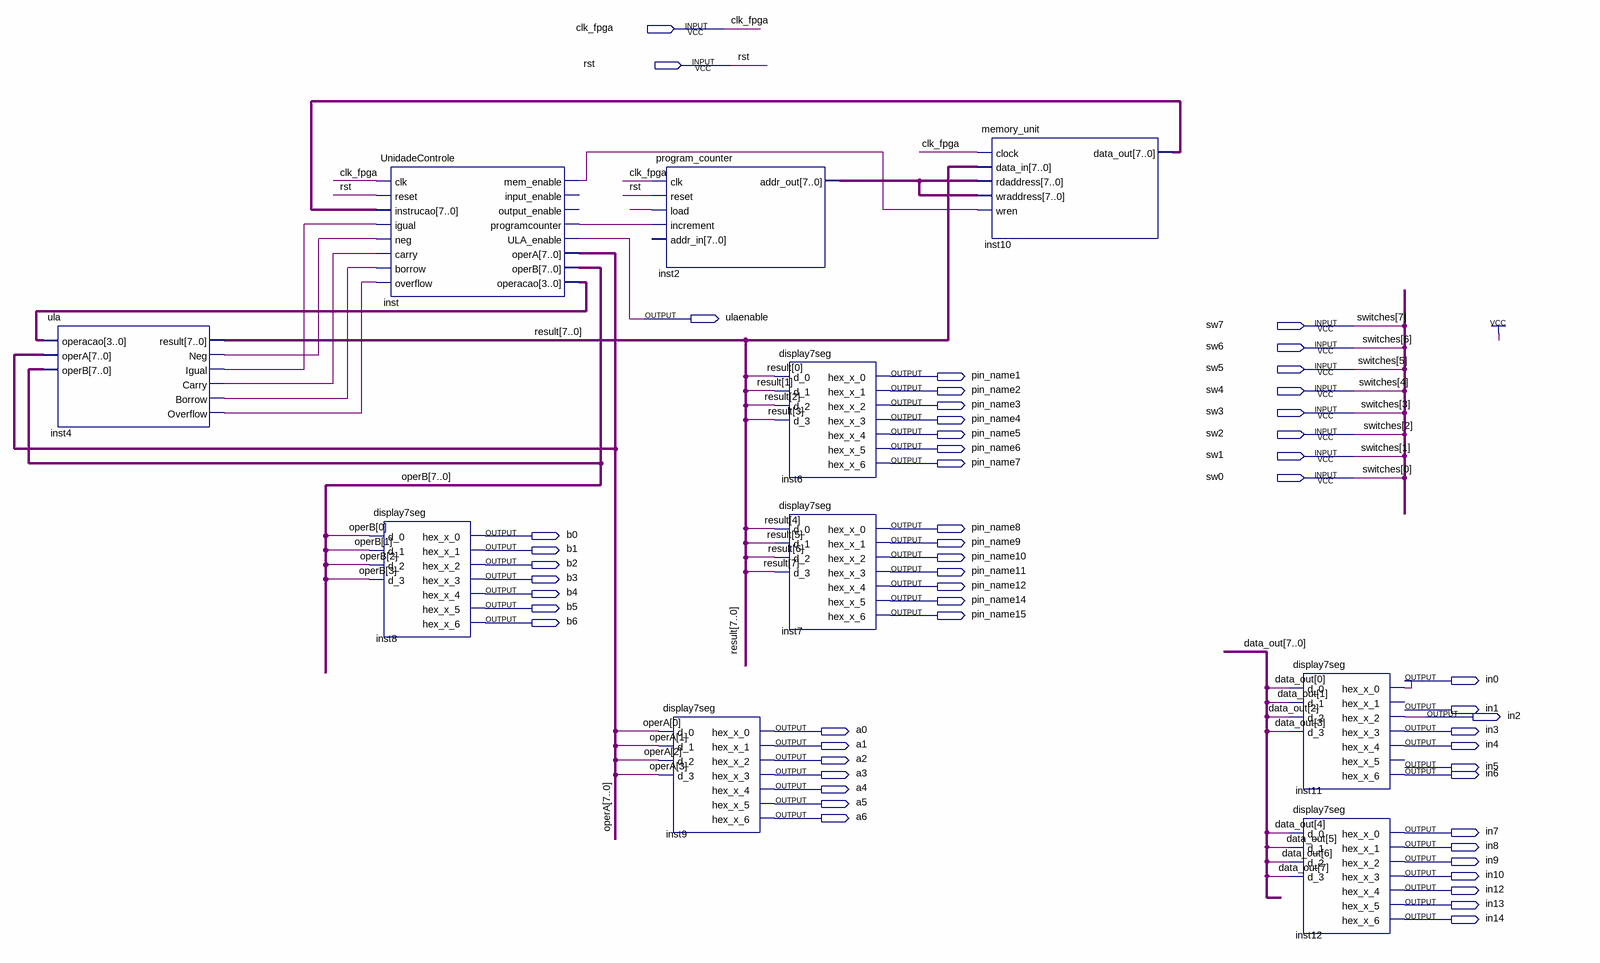
[diagram p0: schematic sheet]
// Quartus schematic cpu.bdf as structural Verilog: 10 symbols, 53 pins
module cpu (
  input  clk_fpga,
  input  rst,
  input  sw7,
  input  sw6,
  input  sw5,
  input  sw4,
  input  sw3,
  input  sw2,
  input  sw1,
  input  sw0,
  output ulaenable,
  output pin_name1,
  output pin_name2,
  output pin_name3,
  output pin_name4,
  output pin_name5,
  output pin_name6,
  output pin_name7,
  output pin_name8,
  output b0,
  output pin_name9,
  output b1,
  output pin_name10,
  output b2,
  output pin_name11,
  output b3,
  output pin_name12,
  output b4,
  output pin_name14,
  output b5,
  output pin_name15,
  output b6,
  output in0,
  output in1,
  output in2,
  output a0,
  output in3,
  output a1,
  output in4,
  output a2,
  output in5,
  output a3,
  output in6,
  output a4,
  output a5,
  output a6,
  output in7,
  output in8,
  output in9,
  output in10,
  output in12,
  output in13,
  output in14
);

  wire inst4_borrow, inst4_carry, inst4_igual, inst4_neg, inst4_overflow, inst_mem_enable,
       inst_programcounter, undriven;
  wire [3:0] inst_operacao;
  wire [7:0] data_out, inst2_addr_out, inst10_data_out, operA, operB, result;

  ula inst4 (
    .operacao(inst_operacao), .operA(operA), .operB(operB), .result(result), .Neg(inst4_neg),
    .Igual(inst4_igual), .Carry(inst4_carry), .Borrow(inst4_borrow), .Overflow(inst4_overflow));
  UnidadeControle inst (
    .clk(clk_fpga), .reset(rst), .instrucao(inst10_data_out), .igual(inst4_igual), .neg(inst4_neg),
    .carry(inst4_carry), .borrow(inst4_borrow), .overflow(inst4_overflow), .mem_enable(inst_mem_enable),
    .programcounter(inst_programcounter), .ULA_enable(ulaenable), .operA(operA), .operB(operB),
    .operacao(inst_operacao));  // open: input_enable, output_enable
  display7seg inst8 (
    .d_0(operB[0]), .d_1(operB[1]), .d_2(operB[2]), .d_3(operB[3]), .hex_x_0(b0), .hex_x_1(b1), .hex_x_2(b2),
    .hex_x_3(b3), .hex_x_4(b4), .hex_x_5(b5), .hex_x_6(b6));
  program_counter inst2 (
    .clk(clk_fpga), .reset(rst), .load(undriven), .increment(inst_programcounter), .addr_out(inst2_addr_out));  // open: addr_in
  display7seg inst9 (
    .d_0(operA[0]), .d_1(operA[1]), .d_2(operA[2]), .d_3(operA[3]), .hex_x_0(a0), .hex_x_1(a1), .hex_x_2(a2),
    .hex_x_3(a3), .hex_x_4(a4), .hex_x_5(a5), .hex_x_6(a6));
  display7seg inst6 (
    .d_0(result[0]), .d_1(result[1]), .d_2(result[2]), .d_3(result[3]), .hex_x_0(pin_name1),
    .hex_x_1(pin_name2), .hex_x_2(pin_name3), .hex_x_3(pin_name4), .hex_x_4(pin_name5), .hex_x_5(pin_name6),
    .hex_x_6(pin_name7));
  display7seg inst7 (
    .d_0(result[4]), .d_1(result[5]), .d_2(result[6]), .d_3(result[7]), .hex_x_0(pin_name8),
    .hex_x_1(pin_name9), .hex_x_2(pin_name10), .hex_x_3(pin_name11), .hex_x_4(pin_name12),
    .hex_x_5(pin_name14), .hex_x_6(pin_name15));
  memory_unit inst10 (
    .clock(clk_fpga), .data_in(result), .rdaddress(inst2_addr_out), .wraddress(inst2_addr_out),
    .wren(inst_mem_enable), .data_out(inst10_data_out));
  display7seg inst11 (
    .d_0(data_out[0]), .d_1(data_out[1]), .d_2(data_out[2]), .d_3(data_out[3]), .hex_x_0(in0), .hex_x_2(in2),
    .hex_x_3(in3), .hex_x_4(in4), .hex_x_6(in6));  // open: hex_x_1, hex_x_5
  display7seg inst12 (
    .d_0(data_out[4]), .d_1(data_out[5]), .d_2(data_out[6]), .d_3(data_out[7]), .hex_x_0(in7), .hex_x_1(in8),
    .hex_x_2(in9), .hex_x_3(in10), .hex_x_4(in12), .hex_x_5(in13), .hex_x_6(in14));

  // Other names for the same wires on the sheet: switches[7:0] = {sw7, sw6, sw5, sw4, sw3, sw2, sw1, sw0}
endmodule
